# Altium schematic sheet 1-Top.SchDoc
size 420 x 297 mm; DocumentNumber: 1; SheetNumber: 1; SheetTotal: 6; PageSetup: Record=PageOptions|CenterHorizontal=True|CenterVertical=True|PrintScale=0.96|XCorrection=1.00|YCorrection=1.00|PrintKind=1|BorderSize=5000000|LeftOffset=0|BottomOffset=0|Orientation=2|PaperLength=4318|PaperWidth=2794|Scale=100|PaperSource=7|PrintQuality=600|MediaType=1|DitherType=10|PaperKind=11" x 17"|PrintScaleMode=1
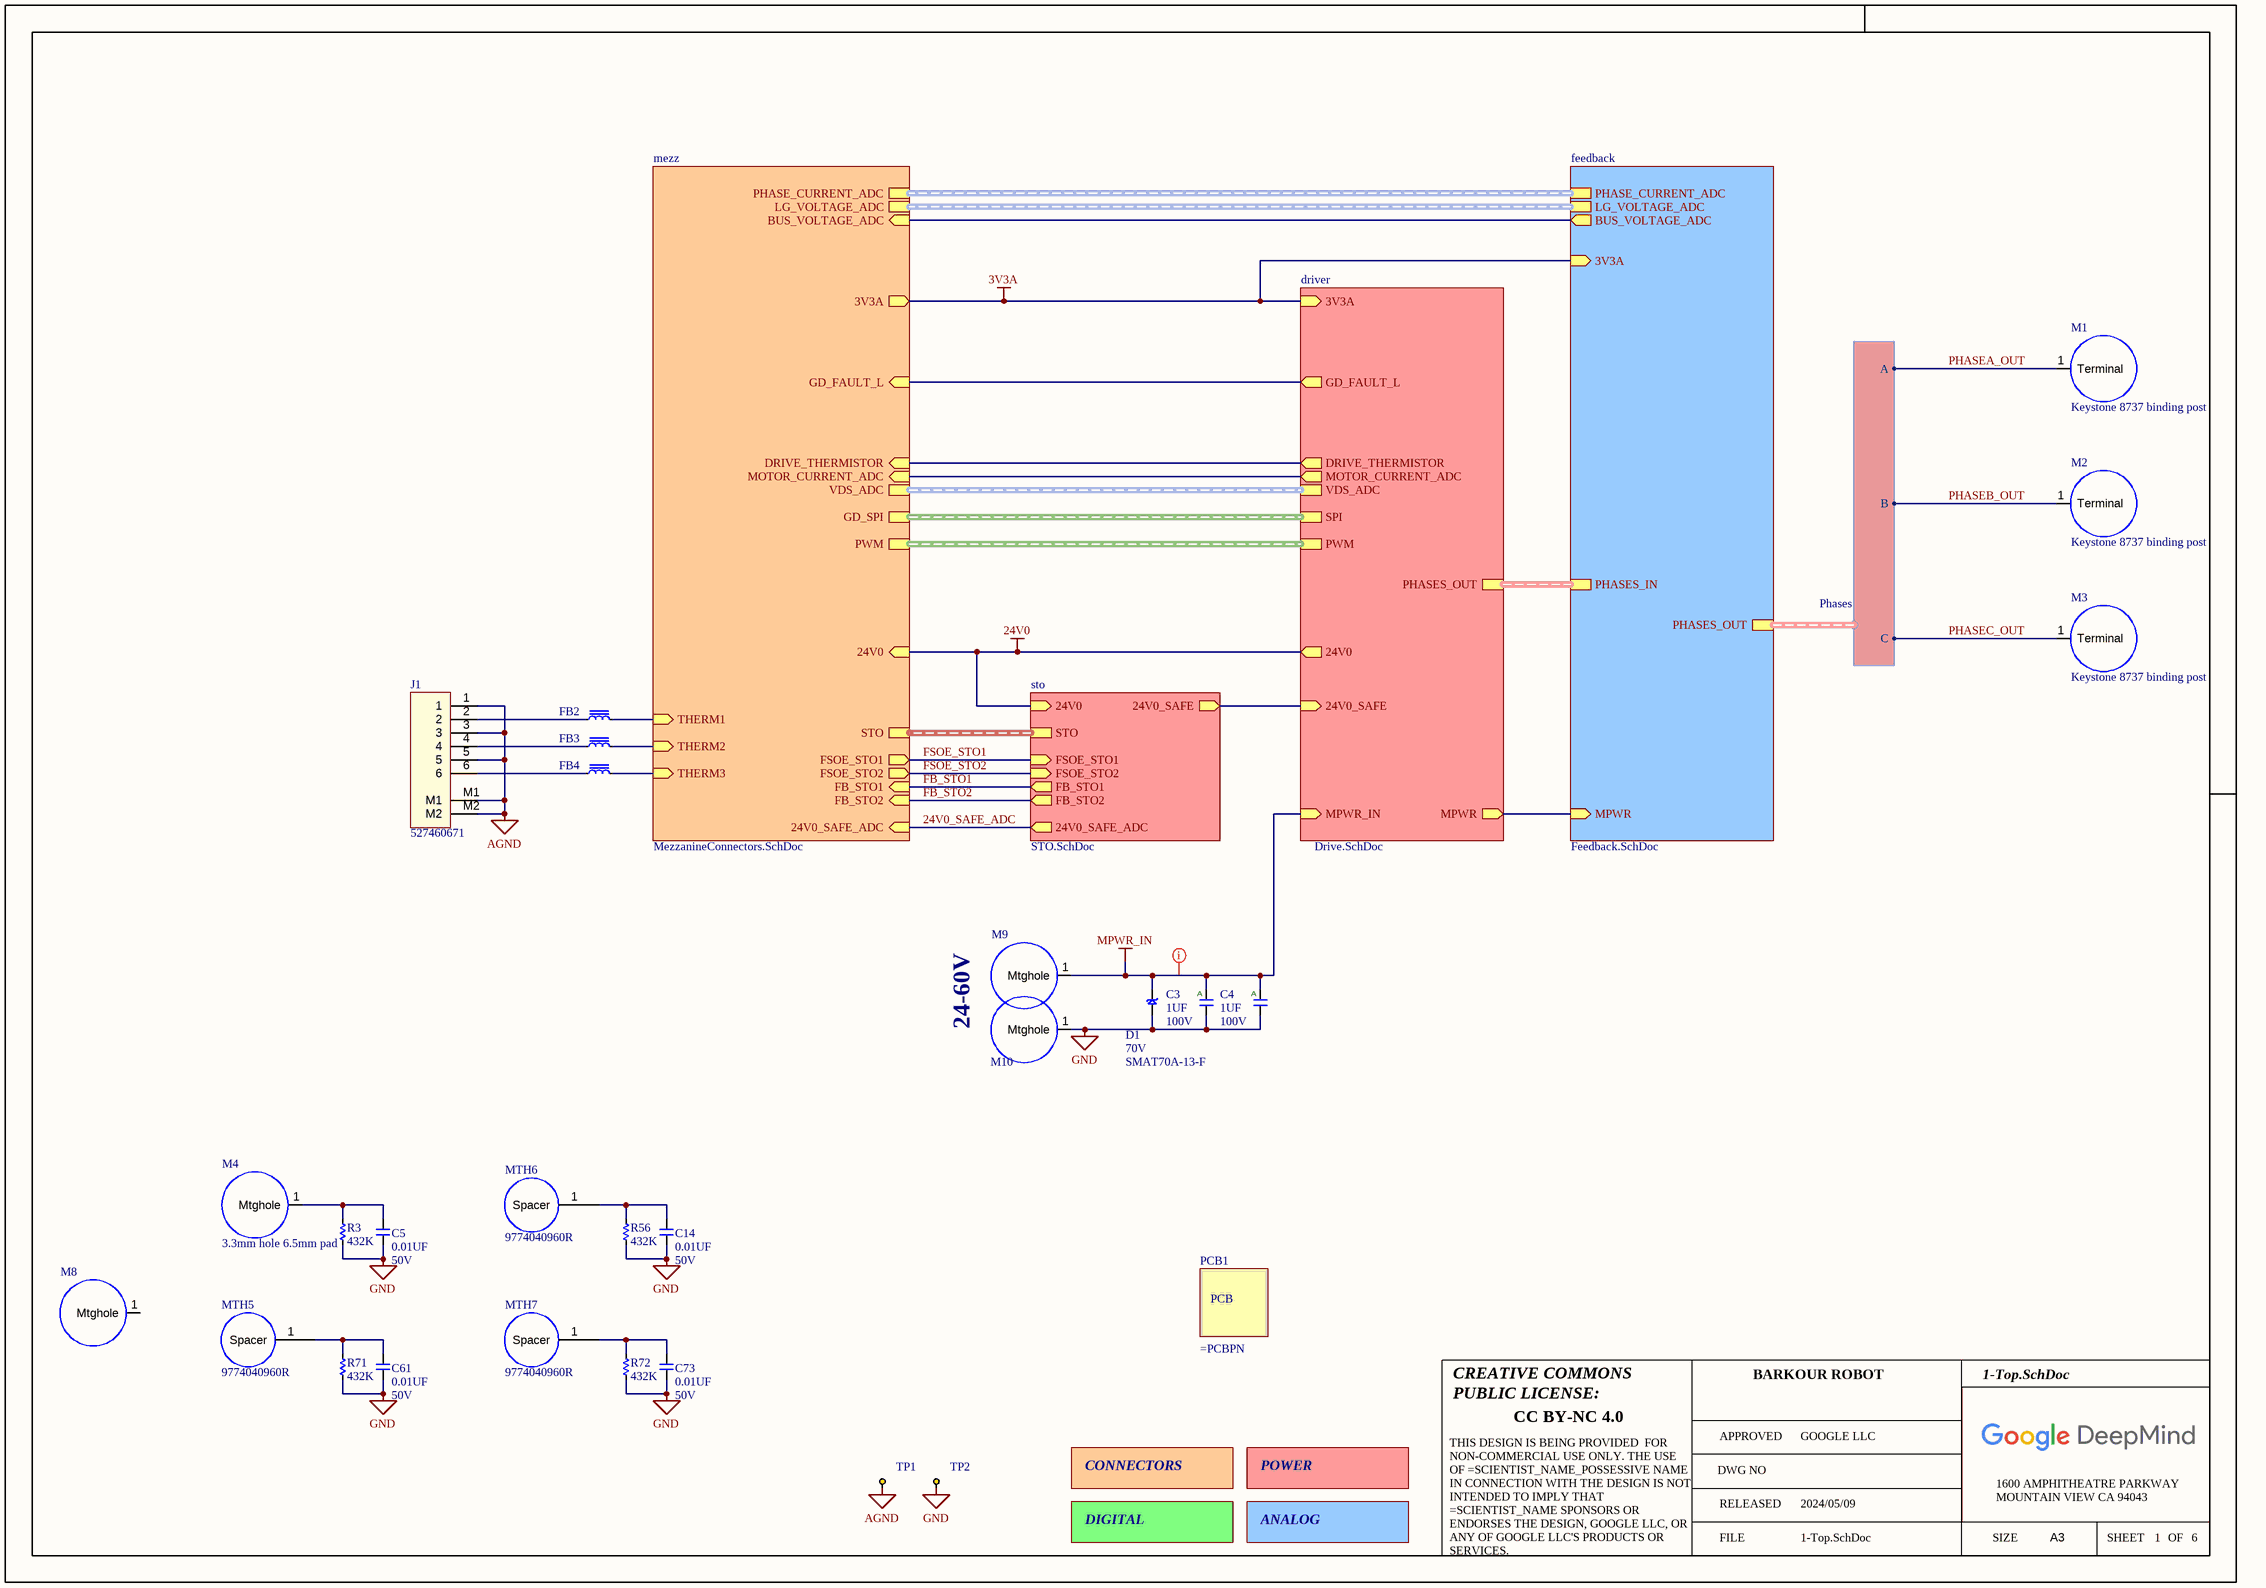
[diagram p0: 1-Top.SchDoc]

## Parts
C3  value 1UF  Voltage: 100V  [C0805]  (hidden comment: __Template_Cap_Auto)
C4  value 1UF  Voltage: 100V  [C0805]  (hidden comment: __Template_Cap_Auto)
C5  value 0.01UF  Voltage: 50V  [C0402]  (hidden comment: __Template_Cap)
C14  value 0.01UF  Voltage: 50V  [C0402]  (hidden comment: __Template_Cap)
C61  value 0.01UF  Voltage: 50V  [C0402]  (hidden comment: __Template_Cap)
C73  value 0.01UF  Voltage: 50V  [C0402]  (hidden comment: __Template_Cap)
D1  value SMAT70A-13-F  Voltage - DC Reverse (VR) (MAX): 70V  [SMA_B130-13-F]  (hidden comment: __Template_Diode_TVS_A/K)
FB2  LAIRD MI0603L221R-10  [INDC160X80X105L30N]  (value not drawn)
FB3  LAIRD MI0603L221R-10  [INDC160X80X105L30N]  (value not drawn)
FB4  LAIRD MI0603L221R-10  [INDC160X80X105L30N]  (value not drawn)
J1  MFG P/N: 527460671  [MOLEX_FPC_527460671]
M1  Keystone 8737 binding post  [Keystone_8737]  (no BOM)
M2  Keystone 8737 binding post  [Keystone_8737]  (no BOM)
M3  Keystone 8737 binding post  [Keystone_8737]  (no BOM)
M4  3.3mm hole 6.5mm pad  [3.3HOLE6.5PAD]  (no BOM)
M8  3.7mm hole 5mm pad  [3.7hole5pad]  (value not drawn)
M9  1.3mm hole 5mm pad  [1.7hole5padSQ]  (value not drawn)  (no BOM)
M10  1.3mm hole 5mm pad  [1.7hole5padRD]  (value not drawn)  (no BOM)
MTH5  9774040960R  [9774040960R]
MTH6  9774040960R  [9774040960R]
MTH7  9774040960R  [9774040960R]
PCB1  (no value)  (mechanical)
R3  value 432K  [R0805]
R56  value 432K  [R0805]
R71  value 432K  [R0805]
R72  value 432K  [R0805]
TP1  TEST_KEYSTONE5001  [TP_KEYSTONE_5001]  (value not drawn)
TP2  TEST_KEYSTONE5001  [TP_KEYSTONE_5001]  (value not drawn)

## Sub-sheets
driver = Drive.SchDoc: PWM (harness PWM), SPI (harness SPI), 24V0 (out), 24V0_SAFE (in), MPWR_IN (in), MOTOR_CURRENT_ADC (out), VDS_ADC (harness Phases), PHASES_OUT (harness Phases), 3V3A (in), GD_FAULT_L (out), DRIVE_THERMISTOR (out), MPWR (out)
feedback = Feedback.SchDoc: PHASE_CURRENT_ADC (harness Phases), PHASES_OUT (harness Phases), PHASES_IN (harness Phases), LG_VOLTAGE_ADC (harness Phases), BUS_VOLTAGE_ADC (out), 3V3A (in), MPWR (in)
mezz = MezzanineConnectors.SchDoc: GD_SPI (harness SPI), PWM (harness PWM), 24V0 (in), 3V3A (out), FB_STO2 (in), FSOE_STO1 (out), FSOE_STO2 (out), FB_STO1 (in), 24V0_SAFE_ADC (in), THERM3 (in), THERM1 (in), THERM2 (in), VDS_ADC (harness Phases), MOTOR_CURRENT_ADC (in), DRIVE_THERMISTOR (in), GD_FAULT_L (in), PHASE_CURRENT_ADC (harness Phases), LG_VOLTAGE_ADC (harness Phases), BUS_VOLTAGE_ADC (in), STO (harness STO)
sto = STO.SchDoc: FB_STO2 (out), FSOE_STO1 (in), FSOE_STO2 (in), FB_STO1 (out), 24V0_SAFE (out), 24V0_SAFE_ADC (out), 24V0 (in), STO (harness STO)

## Harnesses
Phases: A, B, C

## Nets
3V3A: sheet feedback/3V3A, sheet driver/3V3A, sheet mezz/3V3A
24V0: sheet driver/24V0, sheet sto/24V0, sheet mezz/24V0
AGND: J1.1 J1.3 J1.5 J1.M1 J1.M2 TP1.1
GND: C3.2 C4.2 C5.2 C14.2 C61.2 C73.2 D1.A M10.1(Mtghole) R3.1 R56.1 R71.1 R72.1 TP2.1
MPWR_IN: C3.1 C4.1 D1.K M9.1(Mtghole) ; sheet driver/MPWR_IN
24V0_SAFE_ADC: sheet sto/24V0_SAFE_ADC, sheet mezz/24V0_SAFE_ADC
FB_STO1: sheet sto/FB_STO1, sheet mezz/FB_STO1
FB_STO2: sheet sto/FB_STO2, sheet mezz/FB_STO2
FSOE_STO1: sheet sto/FSOE_STO1, sheet mezz/FSOE_STO1
FSOE_STO2: sheet sto/FSOE_STO2, sheet mezz/FSOE_STO2
PHASEA_OUT: M1.1(Terminal) ; sheet feedback/PHASES_OUT.A
PHASEB_OUT: M2.1(Terminal) ; sheet feedback/PHASES_OUT.B
PHASEC_OUT: M3.1(Terminal) ; sheet feedback/PHASES_OUT.C
NetC5_1: C5.1 M4.1(Mtghole) R3.2
NetC14_1: C14.1 MTH6.1(Spacer) R56.2
NetC61_1: C61.1 MTH5.1(Spacer) R71.2
NetC73_1: C73.1 MTH7.1(Spacer) R72.2
NetFB2_1: FB2.1 J1.2
NetFB2_2: FB2.2 ; sheet mezz/THERM1
NetFB3_1: FB3.1 J1.4
NetFB3_2: FB3.2 ; sheet mezz/THERM2
NetFB4_1: FB4.1 J1.6
NetFB4_2: FB4.2 ; sheet mezz/THERM3
(unnamed): sheet feedback/BUS_VOLTAGE_ADC, sheet mezz/BUS_VOLTAGE_ADC
(unnamed): sheet feedback/MPWR, sheet driver/MPWR
(unnamed): sheet driver/24V0_SAFE, sheet sto/24V0_SAFE
(unnamed): sheet driver/MOTOR_CURRENT_ADC, sheet mezz/MOTOR_CURRENT_ADC
(unnamed): sheet driver/GD_FAULT_L, sheet mezz/GD_FAULT_L
(unnamed): sheet driver/DRIVE_THERMISTOR, sheet mezz/DRIVE_THERMISTOR

Not connected (* = marked no-connect by the designer): M8 1(Mtghole)

## Buses and harness runs
harness sheet driver/PHASES_OUT = sheet feedback/PHASES_IN
harness sheet driver/PWM = sheet mezz/PWM
harness sheet driver/SPI = sheet mezz/GD_SPI
harness sheet driver/VDS_ADC = sheet mezz/VDS_ADC
harness sheet feedback/LG_VOLTAGE_ADC = sheet mezz/LG_VOLTAGE_ADC
harness sheet feedback/PHASE_CURRENT_ADC = sheet mezz/PHASE_CURRENT_ADC
harness sheet mezz/STO = sheet sto/STO

## Layout directives
net class HV: MPWR_IN

## Notes on the sheet
- 24-60V
- CONNECTORS
- POWER
- DIGITAL
- ANALOG
- CREATIVE COMMONS
- PUBLIC LICENSE:
- BARKOUR ROBOT
- CC BY-NC 4.0
- APPROVED
- DWG NO
- GOOGLE LLC
- FILE
- RELEASED
- 2024/05/09
- SIZE
- 1600 AMPHITHEATRE PARKWAY
- MOUNTAIN VIEW CA 94043
- A3
- SHEET
- OF
- THIS DESIGN IS BEING PROVIDED  FOR NON-COMMERCIAL USE ONLY. THE USE OF =SCIENTIST_NAME_POSSESSIVE NAME IN CONNECTION WITH THE DESIGN IS NOT INTENDED TO IMPLY THAT =SCIENTIST_NAME SPONSORS OR ENDORSES THE DESIGN, GOOGLE LLC, OR ANY OF GOOGLE LLC'S PRODUCTS OR SERVICES.
- (in symbol 1093) A

## Library data of the parts
C3 C4 = 1093: CAP, CER, X7S, 1uF, 20%, 100V, 0805; ID: 1093; MFG: TDK; MFG P/N: CGA4J3X7S2A105M125AE; XPN: XS-10001040; COMMON: 150-01093-00; PROXY: 150-03473-00; EES: 150-04579-00; Status: Released; Package: 0805; Dielectric: X7S; Tolerance: 20%; Height: 1.5mm T; ComponentLink1Description: Datasheet; LOON: 150-01093-00; Gecko: 150-01093-00
C5 C14 C61 C73 = 625: CAP, CER, X7R, 0.01uF, 50V, 20%, 0402, 0.56mm T; ID: 625; MFG: KEMET; MFG P/N: C0402C103M5RACTU; XPN: 150-00227-00; EES: 150-04592-00; Status: Released; Package: 0402; Dielectric: X7R; Tolerance: 20%; Height: 0.56mm T; ComponentLink1Description: Datasheet; COMMON: 150-00227-00; LOON: 150-00227-00; Gecko: 150-00227-00
D1 = 200: DIODE, TVS, UNI-DIR, 70VR, 100VCL, 400W, 140PF @1MHZ, SMA; ID: 200; MFG: Diodes Incorporated; PROXY: 480-01326-00; Voltage - Clamping (Max) @ Ipp: 100V; Status: Released; MFG P/N: SMAT70A-13-F; Package: SMA; Category: Diode; RoHS Compliant: Yes; Diode Type: TVS; Mounting Type: SMD; Operating Temperature – Junction: -55°C ~ 150°C (TJ); Supplier 1: Digi-Key; HelpURL: https://www.digikey.in/product-detail/en/diodes-incorporated/SMAT70A-13-F/SMAT70A-FDICT-ND/804910; ComponentLink1Description: Datasheet; ComponentLink1URL: https://www.diodes.com/assets/Datasheets/ds30213.pdf; Supplier Part Number 1: SMAT70A-FDICT-ND
FB2-FB4 = f5bd4cf1-070f-4480-bf1a-f8cba0e78574: FERRITE BEAD 220 OHM 0603 1LN; Manufacturer: Laird Technologies; Grade: Commercial; Value: 220 Ohms @ 100 MHz; Current Rating: 2A; ComponentId: f5bd4cf1-070f-4480-bf1a-f8cba0e78574; Manufacturer Part Number: MI0603L221R-10; Package: Inductor, 0603; ComponentLink1Description: Datasheet; ComponentLink1URL: https://media.digikey.com/pdf/Data%20Sheets/Laird%20Technologies/EMI_Filtering_and_RF_Inductors.pdf; Category: Ferrite Beads; Status: Preliminary; Storage Temperature: -40 °C ~ 125 °C; Operating Temperature: -40 °C ~ 125 °C
J1 = 1210: CONN, FFC, RA, 1x6 P, 0.5MM PITCH, 2.3MM H, GOLD, SMD; ID: 1210; MFG: Molex; Number of Positions: 6; Current Rating: 0.5A; Voltage, Rated: 50V; EES: 210-04996-00; Sub Assy Qty 2: 0; Status: Released; RoHS Compliant: Yes; Connector Type: FFC; Mounting Type: Surface Mount; Orientation: Right Angle; Pitch: 0.5mm; Number of Rows: 1; Features: Contacts, Bottom; Operating Temperature: -20°C ~ 85°C; Supplier 1: Digi-Key; HelpURL: https://www.digikey.com/en/products/detail/molex/0527460671/2074148?s=N4IgTCBcDaIKxgOwBYBsAGViCMIC6AvkA; ComponentLink1Description: Datasheet; ComponentLink1URL: https://www.molex.com/pdm_docs/sd/527460671_sd.pdf; Height: 2.3mm; Supplier Part Number 1: WM7977TR-ND; Sub Assy Qty 3: 0; Sub Assy Qty 4: 0
M1-M3 = Keystone_8737_post: 1.5mm hole 5.6mm pad
M4 = MtgHole_2
M8 = MtgHole
M9 M10 = MtgHole_1
MTH5-MTH7 = Wurth_4mm_Spacer_9774040960R: Spacer Material: Steel Mounting: SMT Series: WA-SMST For ø: 3.3 mm; Manufacturer: Wurth Electronics; Plating: Tin; Threaded/Unthreaded: Unthreaded; Inside Diameter: 0.13inch; Outside Diameter: 0.236inch; Supplier 1: Digi-Key; Manufacturer Part Number: 9774040960R; RoHS: Yes; Category: Spacers, Standoffs; Stock 1: 190; Pricing 1: 1=1.79000, 10=1.71600, 50=1.50700, 100=1.40200 (USD); Material: Steel; Length: 0.213inch; REACH SVHC: Unknown; ComponentLink1URL: http://www.farnell.com/datasheets/1960394.pdf?src-supplier=Farnell; ComponentLink1Description: http://www.farnell.com/datasheets/1960394.pdf?src-supplier=Farnell; ComponentLink2URL: http://www.mouser.com/ds/2/445/9774040960R-611108.pdf?src-supplier=Mouser; ComponentLink2Description: http://www.mouser.com/ds/2/445/9774040960R-611108.pdf?src-supplier=Mouser; ComponentLink3URL: https://media.digikey.com/pdf/Data%20Sheets/Wurth%20Electronics%20PDFs/WA-SMSx_Performance_Flyer.pdf?src-supplier=Digi-Key; ComponentLink3Description: https://media.digikey.com/pdf/Data%20Sheets/Wurth%20Electronics%20PDFs/WA-SMSx_Performance_Flyer.pdf?src-supplier=Digi-Key; ComponentLink4URL: http://www.farnell.com/datasheets/1960394.pdf?src-supplier=Element14; ComponentLink4Description: http://www.farnell.com/datasheets/1960394.pdf?src-supplier=Element14; ComponentLink5URL: http://www.farnell.com/datasheets/1960394.pdf?src-supplier=Newark; ComponentLink5Description: http://www.farnell.com/datasheets/1960394.pdf?src-supplier=Newark; Supplier Part Number 1: 732-7092-1-ND
PCB1 = 110: PCB; ID: 110; Level: 1; FindNumber: 010; Org: ORG - REP; Type: PCB; GPN: =GPN_PCB; Status: In Development; MFG P/N: =PCBPN; PROXY: =PCBPN; Type: 651-PCB; ItemNumber: =PCBPN; ProductLine: Proxy
R3 R56 R71 R72 = 5492: Resistor, 432K Ohms, 0805, 0.125W, ±1%; ID: 5492; MFG: YAGEO; MFG P/N: RC0805FR-07432KL; Power: 1/8W; COMMON: 470-08723-00; XPN: XS-10019230; Status: Released; Package: 0805; Tolerance: 1%; Height: 0.60mm; Supplier 1: Digi-Key; LOON: 470-08723-00; Gecko: 470-08723-00; Supplier Part Number 1: 311-432KCRCT-ND
TP1 TP2 = TEST_KEYSTONE5001: PC TEST POINT TH RING; Manufacturer: Keystone Electronics; Manufacturer Part Number: 5001; Part Number: 250-00184-00; Supplier 1: Digi-Key; Supplier Part Number 1: 5001K-ND; RoHS: RoHS Compliant; Category: Test and Measurement; Stock 1: 341830; Pricing 1: 1=0.33, 10=0.309, 50=0.2252, 100=0.2164, 250=0.19432, 500=0.18548, 1000=0.15456, 2500=0.14131, 5000=0.13248 (USD); Packaging: Bulk; Type: PC Test Point, Miniature; Terminal: 0.010" x 0.020" (0.25mm x 0.51mm) Phosphor Bronze Wire, Silver Plate; Mounting Type: 0.040" (1.02mm) Hole Diameter; Material: Base, Nylon 46, UL 94V-0; Color: Black; ComponentLink1URL: http://www.keyelco.com/product-pdf.cfm?p=1310; ComponentLink1Description: http://www.keyelco.com/product-pdf.cfm?p=1310